# Altium schematic sheet Sheet2.SchDoc: Counter circuit
size A4; ApprovedBy: alexander.marinsek@gmail.com; Author: Alexander Marinšek; Revision: 1.0; SheetNumber: 2; SheetTotal: 2
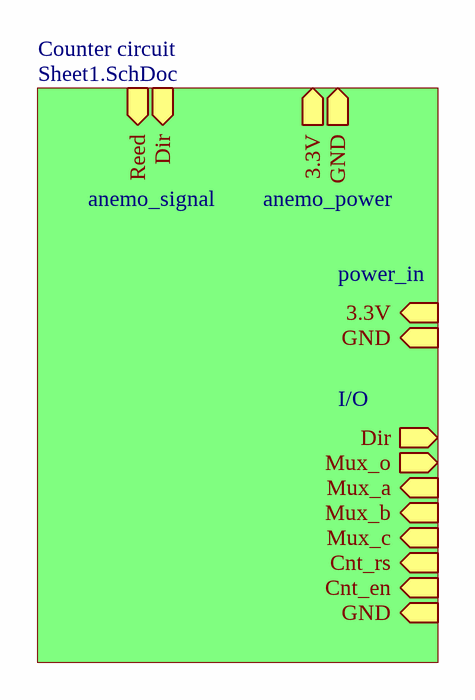
[diagram p0: Sheet2.SchDoc]

## Sub-sheets
Counter circuit = Sheet1.SchDoc: Mux_b (in), Mux_o (out), Dir (out), GND (out), Dir (in), 3.3V (in), Reed (in), Cnt_rs (in), 3.3V (out), Cnt_en (in), Mux_a (in), GND (in), Mux_c (in), GND (in)

## Notes on the sheet
- anemo_signal
- anemo_power
- power_in
- I/O
- Title
- Size:
- Date:
- A4
- Revision:
- Sheet
- of
- Author:
- Contact: